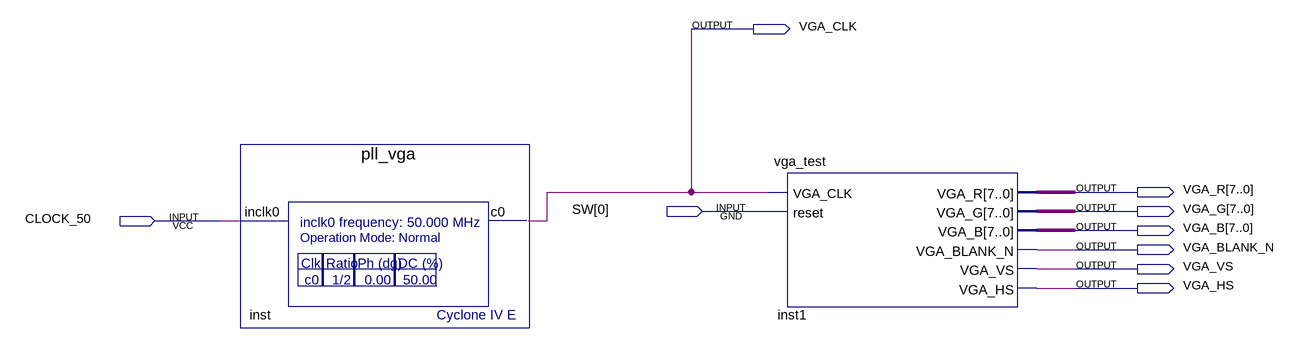
[diagram p0: schematic sheet]
// Quartus schematic vga_pronto.bdf as structural Verilog: 2 symbols, 9 pins
module vga_pronto (
  input  [0:0] SW,
  input  CLOCK_50,
  output VGA_CLK,
  output [7:0] VGA_R,
  output [7:0] VGA_G,
  output [7:0] VGA_B,
  output VGA_BLANK_N,
  output VGA_VS,
  output VGA_HS
);

  pll_vga inst (.inclk0(CLOCK_50), .c0(VGA_CLK));
  vga_test inst1 (
    .VGA_CLK(VGA_CLK), .reset(SW[0]), .VGA_R(VGA_R), .VGA_G(VGA_G), .VGA_B(VGA_B), .VGA_BLANK_N(VGA_BLANK_N),
    .VGA_VS(VGA_VS), .VGA_HS(VGA_HS));
endmodule
